# Altium project ESP32S3.PrjPcb
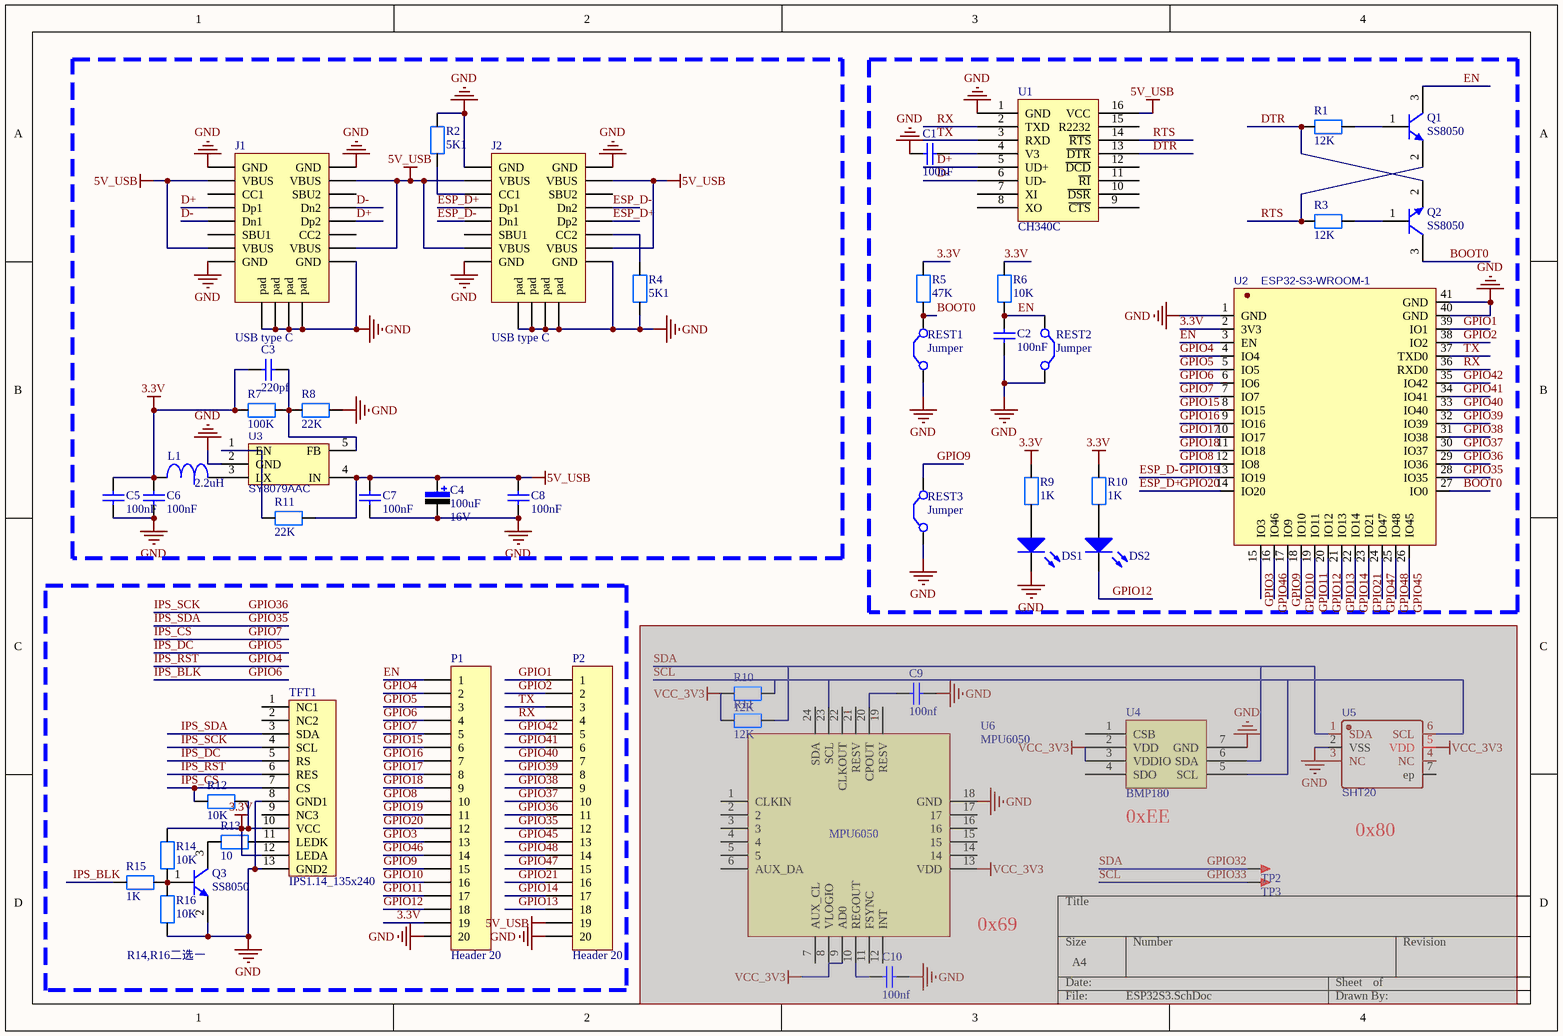
[diagram p0: ESP32S3.SchDoc]
1 sheet, 50 parts. Net scope: global (net labels, ports and power ports of the same name join across sheets).
Board file: ESP32S3.PcbDoc

## Sheet ESP32S3.SchDoc
size A4; SheetNumber: 1; SheetTotal: 1

### Parts
(Parts that share a designator on the sheet are numbered #1, #2 ... from top to bottom, then left to right.)
C1  value 100nF  [0402_CAP]  (hidden comment: Cap)
C2  value 100nF  [0402_CAP]  (hidden comment: Cap)
C3  value 220pf  [0402_CAP]  (hidden comment: Cap)
C4  value 100uF  Vol: 16V  [CAP-3216]  (hidden comment: Cap Pol)
C5  value 100nF  [1206_CAP]  (hidden comment: Cap)
C6  value 100nF  [0402_CAP]  (hidden comment: Cap)
C7  value 100nF  [0402_CAP]  (hidden comment: Cap)
C8  value 100nF  [0402_CAP]  (hidden comment: Cap)
C9  value 100nf  [0402_CAP]  (hidden comment: Cap)  (masked out: inside a compile mask, not in the netlist)
C10  value 100nf  [0402_CAP]  (hidden comment: Cap)  (masked out: inside a compile mask, not in the netlist)
DS1  LED  [0402_LED]  (value not drawn)
DS2  LED  [0402_LED]  (value not drawn)
J1  USB type C  [USB Type-C-16Pin_A]
J2  USB type C  [USB Type-C-16Pin_A]
L1  2.2uH  [L 1206]
P1  Header 20  [HDR-1X20]
P2  Header 20  [HDR-1X20]
Q1  SS8050  [SOT23A]
Q2  SS8050  [SOT23A]
Q3  SS8050  [SOT23A]
R1  12K  [0402_RES]
R2  5K1  [0402_RES]
R3  12K  [0402_RES]
R4  5K1  [0402_RES]
R5  47K  [0402_RES]
R6  10K  [0402_RES]
R7  100K  [0402_RES]
R8  22K  [0402_RES]
R9  1K  [0402_RES]
R10#1  1K  [0402_RES]
R10#2  12K  [0402_RES]  (masked out: inside a compile mask, not in the netlist)
R11#1  22K  [0402_RES]
R11#2  12K  [0402_RES]  (masked out: inside a compile mask, not in the netlist)
R12  10K  [0402_RES]
R13  10  [0402_RES]
R14  10K  [0402_RES]
R15  1K  [0402_RES]
R16  10K  [0402_RES]
REST1  Jumper  [SW-SMD_L4.0-W2.9-LS5.0]
REST2  Jumper  [SW-SMD_L4.0-W2.9-LS5.0]
REST3  Jumper  [SW-SMD_L4.0-W2.9-LS5.0]
TFT1  IPS1.14_135x240  [IPS-1.14]
TP2  TEST  [TEST1.0]  (value not drawn)  (masked out: inside a compile mask, not in the netlist)
TP3  TEST  [TEST1.0]  (value not drawn)  (masked out: inside a compile mask, not in the netlist)
U1  CH340C  [SO-16]
U2  ESP32-S3-WROOM-1  [WIRELM-SMD_ESP32-S3-WROOM-1]
U3  SY8079AAC  [SOT-23-5_L3.0-W1.7-P0.95-LS2.8-TL]
U4  BMP180  [LGA-7_L3.8-W3.6-P1.50-BL]  (masked out: inside a compile mask, not in the netlist)
U5  SHT20  [DFN-6_L3.0-W3.0-P0.95-TR-EP]  (masked out: inside a compile mask, not in the netlist)
U6  MPU6050  [QFN24 4X4_N]  (masked out: inside a compile mask, not in the netlist)

### Blocks framed on the sheet
R14,R16二选一: P1 P2 Q3 R12-R16 TFT1

### Nets
3.3V: C3.1 C5.2 C6.2 L1.1 P1.19 R5.2 R6.1 R7.2 R9.1 R10#1.1 R12.2 R14.2 TFT1.10(VCC) TFT1.12(LEDA) U2.2(3V3)
5V_USB: C4.1 C7.2 C8.2 J1.A4(VBUS) J1.A9(VBUS) J1.B4(VBUS) J1.B9(VBUS) J2.A4(VBUS) J2.A9(VBUS) J2.B4(VBUS) J2.B9(VBUS) P2.19 R11#1.1 U1.16(VCC) U3.4(IN)
GND: C1.1 C2.1 C4.2 C5.1 C6.1 C7.1 C8.1 DS1.2(K) J1.1(pad) J1.A1(GND) J1.A12(GND) J1.B1(GND) J1.B12(GND) J2.1(pad) J2.A1(GND) J2.A12(GND) J2.B1(GND) J2.B12(GND) P1.20 P2.20 Q3.2(E) R2.1 R4.2 R8.1 R16.2 REST1.1(C1) REST2.2(C2) REST3.1(C1) TFT1.8(GND1) TFT1.13(GND2) U1.1(GND) U2.1(GND) U2.40(GND) U2.41(GND) U3.2(GND)
BOOT0: Q2.3(C) R5.1 REST1.2(C2) U2.27(IO0)
D+: J1.A6(Dp1) J1.B6(Dp2) U1.5(UD+)
D-: J1.A7(Dn1) J1.B7(Dn2) U1.6(UD-)
DTR: Q2.2(E) R1.1 U1.13(~{DTR})
EN: C2.2 P1.1 Q1.3(C) R6.2 REST2.1(C1) U2.3(EN)
ESP_D+: J2.A6(Dp1) J2.B6(Dp2) P1.12 U2.14(IO20)  [also labelled GPIO20]
ESP_D-: J2.A7(Dn1) J2.B7(Dn2) P1.11 U2.13(IO19)  [also labelled GPIO19]
GPIO1: P2.1 U2.39(IO1)
GPIO2: P2.2 U2.38(IO2)
GPIO3: P1.13 U2.15(IO3)
GPIO4: P1.2 TFT1.6(RES) U2.4(IO4)  [also labelled IPS_RST]
GPIO5: P1.3 TFT1.5(RS) U2.5(IO5)  [also labelled IPS_DC]
GPIO6: P1.4 R15.1 U2.6(IO6)  [also labelled IPS_BLK]
GPIO7: P1.5 R12.1 TFT1.7(CS) U2.7(IO7)  [also labelled IPS_CS]
GPIO8: P1.10 U2.12(IO8)
GPIO9: P1.15 REST3.2(C2) U2.17(IO9)
GPIO10: P1.16 U2.18(IO10)
GPIO11: P1.17 U2.19(IO11)
GPIO12: DS2.2(K) P1.18 U2.20(IO12)
GPIO13: P2.18 U2.21(IO13)
GPIO14: P2.17 U2.22(IO14)
GPIO15: P1.6 U2.8(IO15)
GPIO16: P1.7 U2.9(IO16)
GPIO17: P1.8 U2.10(IO17)
GPIO18: P1.9 U2.11(IO18)
GPIO21: P2.16 U2.23(IO21)
GPIO35: P2.12 TFT1.3(SDA) U2.28(IO35)  [also labelled IPS_SDA]
GPIO36: P2.11 TFT1.4(SCL) U2.29(IO36)  [also labelled IPS_SCK]
GPIO37: P2.10 U2.30(IO37)
GPIO38: P2.9 U2.31(IO38)
GPIO39: P2.8 U2.32(IO39)
GPIO40: P2.7 U2.33(IO40)
GPIO41: P2.6 U2.34(IO41)
GPIO42: P2.5 U2.35(IO42)
GPIO45: P2.13 U2.26(IO45)
GPIO46: P1.14 U2.16(IO46)
GPIO47: P2.15 U2.24(IO47)
GPIO48: P2.14 U2.25(IO48)
RTS: Q1.2(E) R3.1 U1.14(~{RTS})
RX: P2.4 U1.2(TXD) U2.36(RXD0)
TX: P2.3 U1.3(RXD) U2.37(TXD0)
NetC1_2: C1.2 U1.4(V3)
NetC3_2: C3.2 R7.1 R8.2 U3.5(FB)
NetDS1_1: DS1.1(A) R9.2
NetDS2_1: DS2.1(A) R10#1.2
NetJ2_A5: J2.A5(CC1) R2.2
NetJ2_B5: J2.B5(CC2) R4.1
NetL1_2: L1.2 U3.3(LX)
NetQ1_1: Q1.1(B) R1.2
NetQ2_1: Q2.1(B) R3.2
NetQ3_1: Q3.1(B) R14.1 R15.2 R16.1
NetQ3_3: Q3.3(C) R13.1
NetR11#1_2: R11#1.2 U3.1(EN)
NetR13_2: R13.2 TFT1.11(LEDK)

Not connected (* = marked no-connect by the designer): J1 A5(CC1) A8(SBU1) B5(CC2) B8(SBU2); J2 A8(SBU1) B8(SBU2); TFT1 1(NC1) 2(NC2) 9(NC3); U1 7(XI) 8(XO) 9(~{CTS}) 10(~{DSR}) 11(~{RI}) 12(~{DCD}) 15(R2232)

### Notes on the sheet
- (near U4) 0xEE
- (near U5) 0x80
- (near U6) 0x69

### Library data of the parts
C1-C3 C5-C10 = Cap: 无极性电容; Published: 8-Jun-2000; LatestRevisionDate: 17-Jul-2002; LatestRevisionNote: Re-released for DXP Platform.; PackageReference: RAD-0.3; Publisher: Altium Limited
C4 = Cap Pol: 极性电解电容; Published: 8-Jun-2000; LatestRevisionDate: 17-Jul-2002; LatestRevisionNote: Re-released for DXP Platform.; PackageReference: RB7.6-15; Publisher: Altium Limited
J1 J2 = Type-C: TYPEC接口-16PIN
L1 = Inductance: 电感
P1 P2 = Header 20: Header, 20-Pin; LatestRevisionDate: 17-Jul-2002; LatestRevisionNote: Re-released for DXP Platform.; Publisher: Altium Limited
Q1-Q3 = SS8050: NPN三极管
R1-R9 R10#1 R10#2 R11#1 R11#2 R12-R16 = RES: 电阻
REST1-REST3 = Jumper: 按键; Published: 24-Mar-1999; LatestRevisionDate: 17-Jul-2002; LatestRevisionNote: Re-released for DXP Platform.; PackageReference: RAD-0.2; Publisher: Altium Limited
TFT1 = IPS1.14_135x240: IPS-135x240; BOM名称: 1.44寸TFT屏; 版权归属: 源创客; 学习资源: www.ooocke.com
TP2 TP3 = TEST: 测试点; 版权归属: 源创客; BOM名称: 测试点; 学习资源: www.ooocke.com
U1 = CH340G: 串口芯片
U2 = ESP32-S3-WROOM-1(N16R2): BOM_Manufacturer: ESPRESSIF 乐鑫; Contributor: lcsc; BOM_Supplier: LCSC; BOM_Supplier Part: C2913205; BOM_Manufacturer Part: ESP32-S3-WROOM-1(N16R2); link: https://atta.szlcsc.comnull; BOM_JLCPCB Part Class: Extended Part; spicePre: U; spiceSymbolName: ESP32-S3-WROOM-1(N16R2)
U3 = SY8079AAC: BOM_Manufacturer: Silergy; BOM_Supplier: LCSC; BOM_Manufacturer Part: SY8079AAC; BOM_Supplier Part: C133751; BOM_JLCPCB Part Class: Extended Part; spicePre: U; spiceSymbolName: SY8079AAC
U4 = BMP180: 气压计BMP180
U5 = SHT20: 温湿度传感器; BOM_Manufacturer: Sensirion; SMT Type: Extend; BOM_Supplier: LCSC; BOM_Manufacturer Part: SHT20; image: //image.lceda.cn/szlcsc/C53865.jpg; BOM_Supplier Part: C53865; BOM_LCSC Assembly: Yes; spicePre: U; spiceSymbolName: SHT20
U6 = MPU6050: 陀螺仪MPU6050